# Altium schematic sheet Sheet1.SchDoc
size A4; SheetNumber: 1; SheetTotal: 1
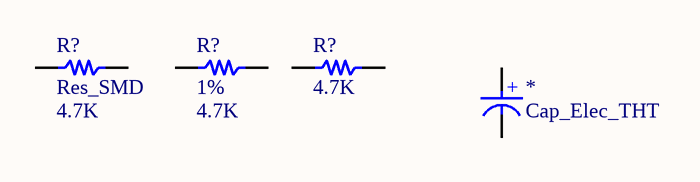
[diagram p0: Sheet1.SchDoc]

## Parts
(Parts that share a designator on the sheet are numbered #1, #2 ... from top to bottom, then left to right.)
*  Cap_Elec_THT
R?#1  Res_SMD  value 4.7K  [Res_SMD_0805]
R?#2  1%  value 4.7K  [Res_SMD_0805]
R?#3  value 4.7K  [Res_SMD_0805]  (hidden comment: LED Blue)

## Nets

Not connected (* = marked no-connect by the designer): * N(Negative) P(Positvie); R?#1 1 2; R?#2 1 2; R?#3 1 2

## Notes on the sheet
- (in symbol Cap_Elec_THT) +

## Library data of the parts
R?#1-R?#3 = Res_SMD: Rating: 0.125W; Type: 1%; Package: 0805